# Altium project main.PrjPcb (part 2 of 2)

## Sheet SunS_Decoupler.SchDoc: SunS separator
size A4; Author: Grzegorz Gajoch; DocumentNumber: 4; SheetNumber: 4; SheetTotal: 16; Model: EM1; PageSetup: Record=PageOptions|CenterHorizontal=True|CenterVertical=True|PrintScale=0.52|XCorrection=1.00|YCorrection=1.00|PrintKind=1|BorderSize=5000000|LeftOffset=0|BottomOffset=0|Orientation=2|PaperLength=4200|PaperWidth=2970|Scale=100|PaperSource=7|PrintQuality=600|MediaType=1|DitherType=10|PaperKind=A3|PrintScaleMode=1
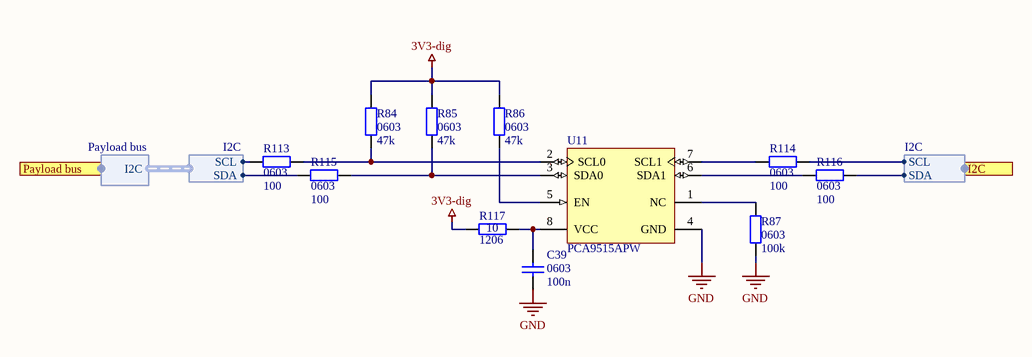
[diagram p10: SunS_Decoupler.SchDoc]

### Parts
C39  0603  value 100n  [SMD_Capacitor_0603]
R84  0603  value 47k  [SMD_Resistor_0603]
R85  0603  value 47k  [SMD_Resistor_0603]
R86  0603  value 47k  [SMD_Resistor_0603]
R87  0603  value 100k  [SMD_Resistor_0603]
R113  0603  value 100  [SMD_Resistor_0603]
R114  0603  value 100  [SMD_Resistor_0603]
R115  0603  value 100  [SMD_Resistor_0603]
R116  0603  value 100  [SMD_Resistor_0603]
R117  1206  value 10  [SMD_Resistor_1206]
U11  PCA9515APW  [PW8_L]

### Ports
I2C (harness I2C), Payload bus (harness Payload bus)

### Harnesses
I2C: SCL, SDA
Payload bus: I2C

### Nets
3V3-dig: R84.2 R85.2 R86.2 R117.2  [project net Vcc3]
GND: C39.1 R87.1 U11.4(GND)  [project net Ground1]
NetC39_2: C39.2 R117.1 U11.8(VCC)
NetP3_1: R113.2 ; harness I2C.SCL
NetP3_2: R115.2 ; harness I2C.SDA
NetR11_1: R116.1 ; port I2C.SDA
NetR12_1: R114.1 ; port I2C.SCL
NetR84_1: R84.1 R113.1 U11.2(SCL0)
NetR85_1: R85.1 R115.1 U11.3(SDA0)
NetR86_1: R86.1 U11.5(EN)
NetR87_2: R87.2 U11.1(NC)
NetR114_2: R114.2 U11.7(SCL1)
NetR116_2: R116.2 U11.6(SDA1)

### Notes on the sheet
- Title:
- Sheet:
- of
- Author:
- Model:
- Document Number:
- Checked by:
- Iss-Rev:
- Approved by:
- Date:
- File name:

### Library data of the parts
C39 = Cap1: Capacitor; Published: 8-Jun-2000; LatestRevisionDate: 17-Jul-2002; LatestRevisionNote: Re-released for DXP Platform.; PackageReference: RAD-0.3; Publisher: Altium Limited; PackageDescription: Radial Cap, Thru-Hole; 2 Leads; 0.3 in Pin Spacing
R84-R87 R113-R117 = Res2: Resistor; Published: 8-Jun-2000; LatestRevisionDate: 17-Jul-2002; LatestRevisionNote: Re-released for DXP Platform.; PackageReference: AXIAL-0.4; Publisher: Altium Limited; PackageDescription: Axial Device, Thru-Hole; 2 Leads; 0.4 in Pin Spacing
U11 = PCA9515APW: Dual Bidirectional I2C Bus and SMBus Repeater, 2 Channel Width, 2.3 to 3.6 V, -40 to 85 degC, 8-pin TSSOP (PW), Green (RoHS & no Sb/Br); Manufacturer: Texas Instruments; SubFamily: I2C Hub, Buffer, Repeater; No. of Outputs: 2; VCC(Max)(V): 3.6; VCC(Min)(V): 2.3; Max Frequency(kHz): 400; Vcc range(V): 2.3 to 5.5; 5V Tolerant I/O: Yes; DatasheetVersion: SCPS150B; PackageVersion: revG, Feb-2011; PackageReference: PW8; PackageDescription: 8-Pin Plastic Thin Small Outline Package 3 x 4.4 mm Body ,0.65 mm Pitch; Supplier 1: Digi-Key; Supplier Part Number 1: PCA9515APW-ND; Supplier 2: Newark; Supplier Part Number 2: 80K2693; Supplier 3: Mouser; Supplier Part Number 3: 595-PCA9515APW; Eco-Plan: Green (RoHS & no Sb/Br); Channel Width: 2; Master Side I2C Bus Capacitance Supported(pF): 400; Slave Side I2C Bus Capacitance Supported(pF): 400; Open Drain I/O Type: Yes; Enable Pin: Yes; Mounting Technology: Surface Mount; PartNumber: PCA9515APW; Code_JEDEC: MO-153; ComponentLink1Description: Datasheet; ComponentLink1URL: http://www.ti.com/general/docs/lit/getliterature.tsp?genericPartNumber=PCA9515A&fileType=pdf

## Sheet FRAM.SchDoc: FRAM Memory
size A3; DocumentNumber: 15; SheetNumber: 15; SheetTotal: 16; Model: EM1; PageSetup: Record=PageOptions|CenterHorizontal=True|CenterVertical=True|PrintScale=0.52|XCorrection=1.00|YCorrection=1.00|PrintKind=1|BorderSize=5000000|LeftOffset=0|BottomOffset=0|Orientation=2|PaperLength=4200|PaperWidth=2970|Scale=100|PaperSource=7|PrintQuality=600|MediaType=1|DitherType=10|PaperKind=A3|PrintScaleMode=1
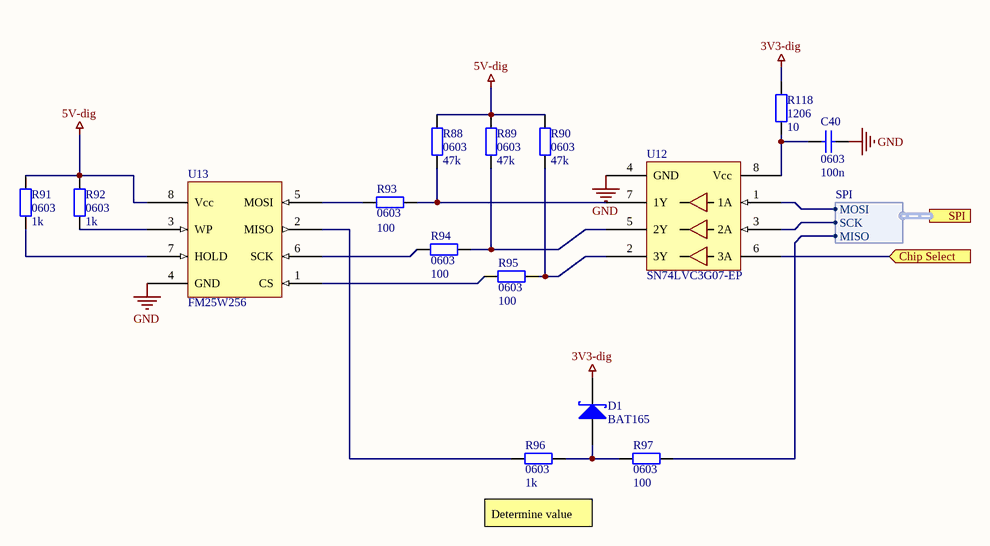
[diagram p11: FRAM.SchDoc]

### Parts
C40  0603  value 100n  [SMD_Capacitor_0603]
D1  BAT165  [SOD323]
R88  0603  value 47k  [SMD_Resistor_0603]
R89  0603  value 47k  [SMD_Resistor_0603]
R90  0603  value 47k  [SMD_Resistor_0603]
R91  0603  value 1k  [SMD_Resistor_0603]
R92  0603  value 1k  [SMD_Resistor_0603]
R93  0603  value 100  [SMD_Resistor_0603]
R94  0603  value 100  [SMD_Resistor_0603]
R95  0603  value 100  [SMD_Resistor_0603]
R96  0603  value 1k  [SMD_Resistor_0603]
R97  0603  value 100  [SMD_Resistor_0603]
R118  1206  value 10  [SMD_Resistor_1206]
U12  SN74LVC3G07-EP  [VSSOP-8]
U13  FM25W256  [SOIC-8-N]

### Ports
Chip Select (in), SPI (harness SPI)

### Harnesses
SPI: MOSI, MISO, SCK

### Nets
3V3-dig: D1.K R118.1  [project net Vcc3]
5V-dig: R88.2 R89.2 R90.2 R91.2 R92.2 U13.8(Vcc)
GND: C40.1 U12.4(GND) U13.4(GND)  [project net Ground1]
CS_FRAM_I: U12.6(3A) ; port Chip Select
MISO_FRAM: R97.1 ; port SPI.MISO
NetC40_2: C40.2 R118.2 U12.8(Vcc)
NetD1_A: D1.A R96.1 R97.2
NetR88_1: R88.1 R93.1 U12.7(1Y)
NetR89_1: R89.1 R94.1 U12.5(2Y)
NetR90_1: R90.1 R95.1 U12.2(3Y)
NetR91_1: R91.1 U13.7(HOLD)
NetR92_1: R92.1 U13.3(WP)
NetR93_2: R93.2 U13.5(MOSI)
NetR94_2: R94.2 U13.6(SCK)
NetR95_2: R95.2 U13.1(CS)
NetR96_2: R96.2 U13.2(MISO)
NetR108_2: U12.3(2A) ; port SPI.SCK
NetR109_2: U12.1(1A) ; port SPI.MOSI

### Notes on the sheet
- Determine value
- Title:
- Sheet:
- of
- Author:
- Model:
- Document Number:
- Checked by:
- Iss-Rev:
- Approved by:
- Date:
- File name:

### Library data of the parts
C40 = Cap1: Capacitor; Published: 8-Jun-2000; LatestRevisionDate: 17-Jul-2002; LatestRevisionNote: Re-released for DXP Platform.; PackageReference: RAD-0.3; Publisher: Altium Limited; PackageDescription: Radial Cap, Thru-Hole; 2 Leads; 0.3 in Pin Spacing
D1 = BAT165: Madium Power AF Schottky 750mA 40V Diode; Manufacturer: Infineon; Value: BAT165
R88-R97 R118 = Res2: Resistor; Published: 8-Jun-2000; LatestRevisionDate: 17-Jul-2002; LatestRevisionNote: Re-released for DXP Platform.; PackageReference: AXIAL-0.4; Publisher: Altium Limited; PackageDescription: Axial Device, Thru-Hole; 2 Leads; 0.4 in Pin Spacing
U12 = SN74LVC3G07-EP: Triple Buffer/Driver With Open-Drain Output
U13 = FM25W256: 256Kb (8k x 32) SPI F-RAM

## Sheet Flash.SchDoc: Flash memory
size A4; Author: Michał Gumiela; DocumentNumber: 1; SheetNumber: 1; SheetTotal: 16; Model: EM1; PageSetup: Record=PageOptions|CenterHorizontal=True|CenterVertical=True|PrintScale=0.52|XCorrection=1.00|YCorrection=1.00|PrintKind=1|BorderSize=5000000|LeftOffset=0|BottomOffset=0|Orientation=2|PaperLength=4200|PaperWidth=2970|Scale=100|PaperSource=7|PrintQuality=600|MediaType=1|DitherType=10|PaperKind=A3|PrintScaleMode=1
Used 2 times, as channels FLASH, FLASH. Parts and nets are listed once, with the designators drawn on the sheet.
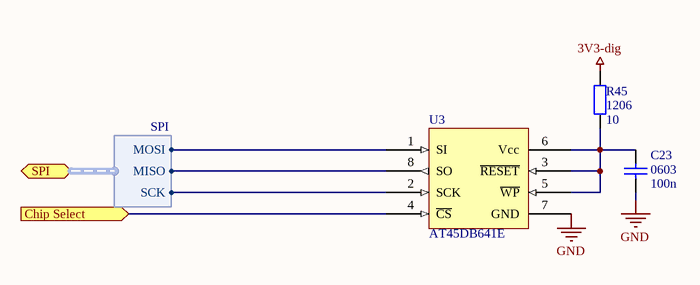
[diagram p12: Flash.SchDoc]

### Parts
C23  0603  value 100n  [SMD_Capacitor_0603]
R45  1206  value 10  [SMD_Resistor_1206]
U3  AT45DB641E  [SOIC-8-N]

### Ports
Chip Select (in), SPI (harness SPI)

### Harnesses
SPI: MOSI, MISO, SCK

### Nets
3V3-dig: R45.1
GND: C23.1 U3.7(GND)
Chip Select: U3.4(~{CS}) ; port Chip Select
NetC23_2: C23.2 R45.2 U3.3(~{RESET}) U3.5(~{WP}) U3.6(Vcc)
NetU3_1: U3.1(SI) ; port SPI.MOSI
NetU3_2: U3.2(SCK) ; port SPI.SCK
NetU3_8: U3.8(SO) ; port SPI.MISO

### Channels
FLASH: designators end in _FLASH#1; ports Chip Select=CS_FLASH_A_I
FLASH: designators end in _FLASH#2; ports Chip Select=CS_FLASH_B_I

### Notes on the sheet
- Title:
- Sheet:
- of
- Author:
- Model:
- Document Number:
- Checked by:
- Iss-Rev:
- Approved by:
- Date:
- File name:

### Library data of the parts
C23 = Cap1: Capacitor; Published: 8-Jun-2000; LatestRevisionDate: 17-Jul-2002; LatestRevisionNote: Re-released for DXP Platform.; PackageReference: RAD-0.3; Publisher: Altium Limited; PackageDescription: Radial Cap, Thru-Hole; 2 Leads; 0.3 in Pin Spacing
R45 = Res2: Resistor; Published: 8-Jun-2000; LatestRevisionDate: 17-Jul-2002; LatestRevisionNote: Re-released for DXP Platform.; PackageReference: AXIAL-0.4; Publisher: Altium Limited; PackageDescription: Axial Device, Thru-Hole; 2 Leads; 0.4 in Pin Spacing
U3 = AT45DB641E: 64-Mbit DataFlash (with Extra 2-Mbits)

## Sheet Watchdog.SchDoc: 24-bit Analog to Digital converter
size A4; Author: Grzegorz Gajoch; DocumentNumber: 6; SheetNumber: 6; SheetTotal: 16; Model: EM1; PageSetup: Record=PageOptions|CenterHorizontal=True|CenterVertical=True|PrintScale=0.52|XCorrection=1.00|YCorrection=1.00|PrintKind=1|BorderSize=5000000|LeftOffset=0|BottomOffset=0|Orientation=2|PaperLength=4200|PaperWidth=2970|Scale=100|PaperSource=7|PrintQuality=600|MediaType=1|DitherType=10|PaperKind=A3|PrintScaleMode=1
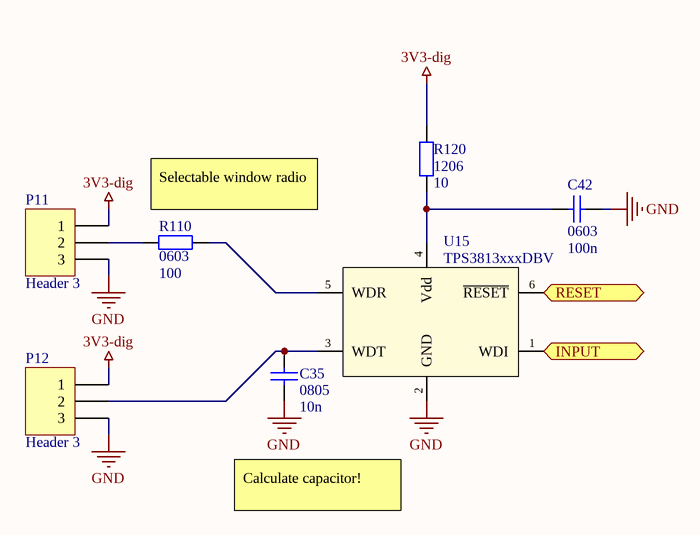
[diagram p13: Watchdog.SchDoc]

### Parts
C35  0805  value 10n  [SMD_Capacitor_0805]
C42  0603  value 100n  [SMD_Capacitor_0603]
P11  Header 3  [HDR1X3]
P12  Header 3  [HDR1X3]
R110  0603  value 100  [SMD_Resistor_0603]
R120  1206  value 10  [SMD_Resistor_1206]
U15  TPS3813xxxDBV  [SOT23-6]

### Ports
INPUT (in), RESET (out)

### Nets
3V3-dig: P11.1 P12.1 R120.1  [project net Vcc3]
GND: C35.1 C42.1 P11.3 P12.3 U15.2(GND)  [project net Ground1]
AT_NRST: U15.6(~{RESET}) ; port RESET
NetC35_2: C35.2 P12.2 U15.3(WDT)
NetC42_2: C42.2 R120.2 U15.4(Vdd)
NetP11_2: P11.2 R110.1
NetR110_2: R110.2 U15.5(WDR)
NetU4_25: U15.1(WDI) ; port INPUT

### Notes on the sheet
- (near R110) Selectable window radio
- Calculate capacitor!
- Title:
- Sheet:
- of
- Author:
- Model:
- Document Number:
- Checked by:
- Iss-Rev:
- Approved by:
- Date:
- File name:

### Library data of the parts
C35 = Cap: Capacitor; Published: 8-Jun-2000; LatestRevisionDate: 17-Jul-2002; LatestRevisionNote: Re-released for DXP Platform.; PackageReference: RAD-0.3; Publisher: Altium Limited; PackageDescription: Radial Cap, Thru-Hole; 2 Leads; 0.3 in Pin Spacing
C42 = Cap1: Capacitor; Published: 8-Jun-2000; LatestRevisionDate: 17-Jul-2002; LatestRevisionNote: Re-released for DXP Platform.; PackageReference: RAD-0.3; Publisher: Altium Limited; PackageDescription: Radial Cap, Thru-Hole; 2 Leads; 0.3 in Pin Spacing
P11 P12 = Header 3: Header, 3-Pin; LatestRevisionDate: 17-Jul-2002; LatestRevisionNote: Re-released for DXP Platform.; Publisher: Altium Limited
R110 R120 = Res2: Resistor; Published: 8-Jun-2000; LatestRevisionDate: 17-Jul-2002; LatestRevisionNote: Re-released for DXP Platform.; PackageReference: AXIAL-0.4; Publisher: Altium Limited; PackageDescription: Axial Device, Thru-Hole; 2 Leads; 0.4 in Pin Spacing
U15 = TPS3813xxxDBV: Processor Supervisory Circuits with Window-Watchdog.; Manufacturer: Texas Instruments; Value: TPS3813xxxDBV

## Sheet SPI Buffer.SchDoc: Flash memory
size A4; Author: Michał Gumiela; DocumentNumber: 14; SheetNumber: 14; SheetTotal: 16; Model: EM1; PageSetup: Record=PageOptions|CenterHorizontal=True|CenterVertical=True|PrintScale=0.52|XCorrection=1.00|YCorrection=1.00|PrintKind=1|BorderSize=5000000|LeftOffset=0|BottomOffset=0|Orientation=2|PaperLength=4200|PaperWidth=2970|Scale=100|PaperSource=7|PrintQuality=600|MediaType=1|DitherType=10|PaperKind=A3|PrintScaleMode=1
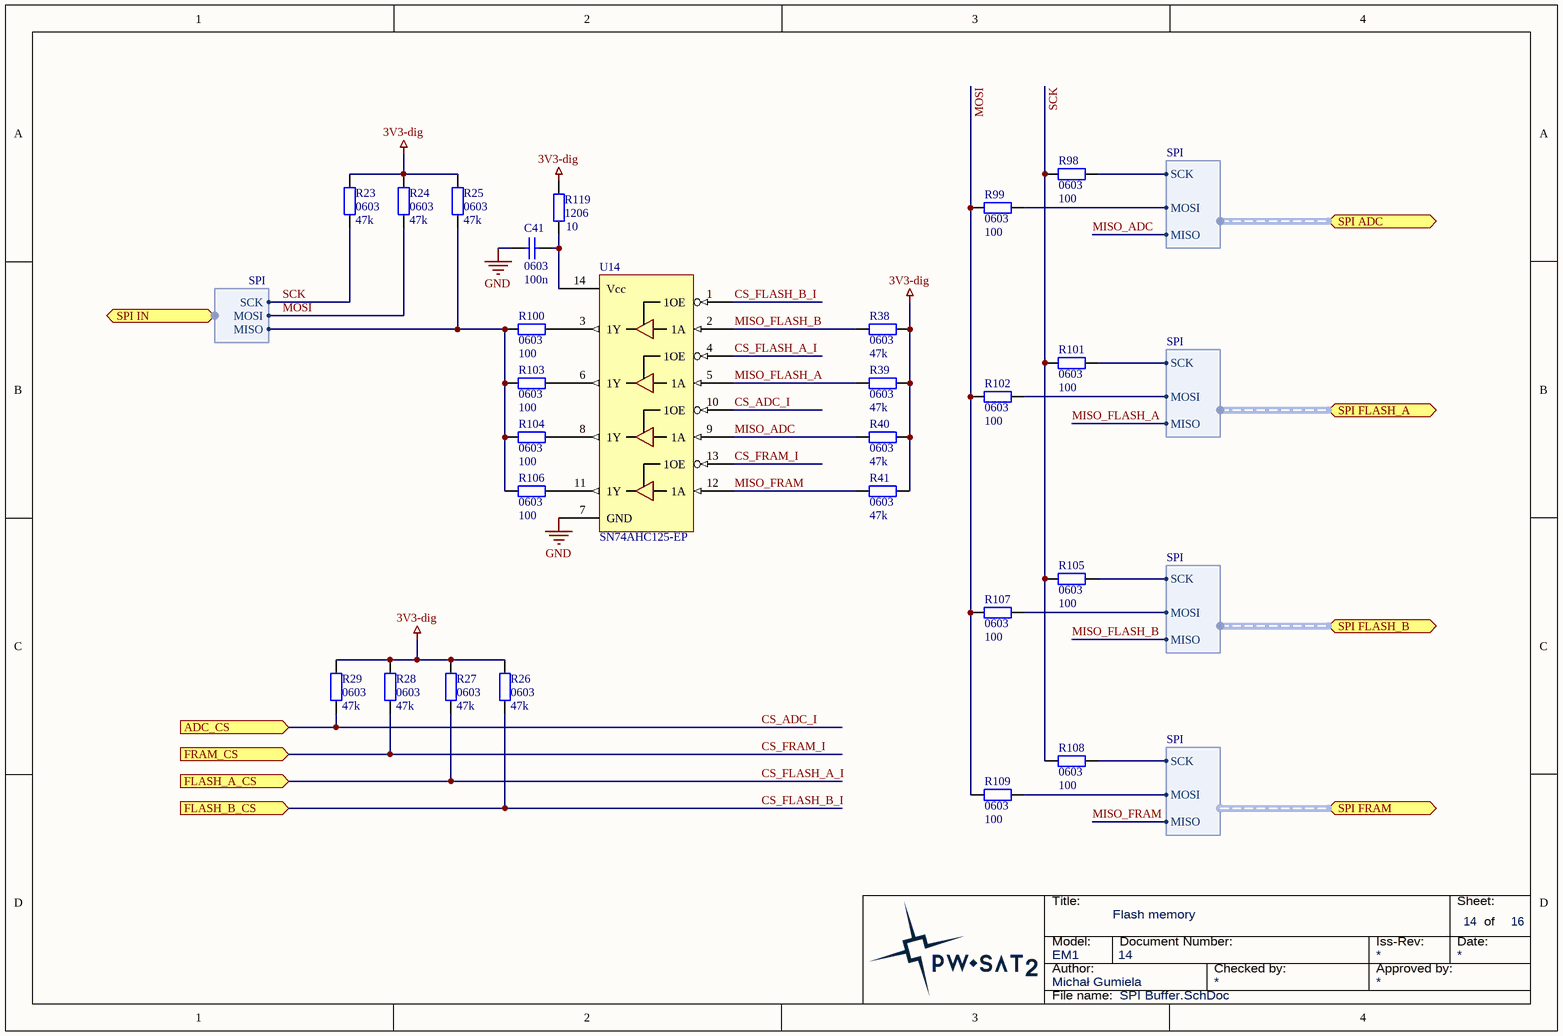
[diagram p14: SPI Buffer.SchDoc]

### Parts
C41  0603  value 100n  [SMD_Capacitor_0603]
R23  0603  value 47k  [SMD_Resistor_0603]
R24  0603  value 47k  [SMD_Resistor_0603]
R25  0603  value 47k  [SMD_Resistor_0603]
R26  0603  value 47k  [SMD_Resistor_0603]
R27  0603  value 47k  [SMD_Resistor_0603]
R28  0603  value 47k  [SMD_Resistor_0603]
R29  0603  value 47k  [SMD_Resistor_0603]
R38  0603  value 47k  [SMD_Resistor_0603]
R39  0603  value 47k  [SMD_Resistor_0603]
R40  0603  value 47k  [SMD_Resistor_0603]
R41  0603  value 47k  [SMD_Resistor_0603]
R98  0603  value 100  [SMD_Resistor_0603]
R99  0603  value 100  [SMD_Resistor_0603]
R100  0603  value 100  [SMD_Resistor_0603]
R101  0603  value 100  [SMD_Resistor_0603]
R102  0603  value 100  [SMD_Resistor_0603]
R103  0603  value 100  [SMD_Resistor_0603]
R104  0603  value 100  [SMD_Resistor_0603]
R105  0603  value 100  [SMD_Resistor_0603]
R106  0603  value 100  [SMD_Resistor_0603]
R107  0603  value 100  [SMD_Resistor_0603]
R108  0603  value 100  [SMD_Resistor_0603]
R109  0603  value 100  [SMD_Resistor_0603]
R119  1206  value 10  [SMD_Resistor_1206]
U14  SN74AHC125-EP  [TSSOP14_L]

### Ports
ADC_CS (in), FLASH_A_CS (in), FLASH_B_CS (in), FRAM_CS (in), SPI ADC (harness SPI), SPI FLASH_A (harness SPI), SPI FLASH_B (harness SPI), SPI FRAM (harness SPI), SPI IN (harness SPI)

### Harnesses
SPI: MOSI, MISO, SCK

### Nets
3V3-dig: R23.2 R24.2 R25.2 R26.2 R27.2 R28.2 R29.2 R38.1 R39.1 R40.1 R41.1 R119.1  [project net Vcc3]
GND: C41.2 U14.7(GND)  [project net Ground1]
CS_ADC_I: R29.1 U14.10(1OE) ; port ADC_CS
CS_FLASH_A_I: R27.1 U14.4(1OE) ; port FLASH_A_CS
CS_FLASH_B_I: R26.1 U14.1(1OE) ; port FLASH_B_CS
CS_FRAM_I: R28.1 U14.13(1OE) ; port FRAM_CS
MISO: R25.1 R100.1 R103.1 R104.1 R106.1 ; port SPI IN.MISO
MISO_ADC: R40.2 U14.9(1A) ; port SPI ADC.MISO
MISO_FLASH_A: R39.2 U14.5(1A) ; port SPI FLASH_A.MISO
MISO_FLASH_B: R38.2 U14.2(1A) ; port SPI FLASH_B.MISO
MISO_FRAM: R41.2 U14.12(1A) ; port SPI FRAM.MISO
MOSI: R24.1 R99.1 R102.1 R107.1 R109.1 ; port SPI IN.MOSI
SCK: R23.1 R98.1 R101.1 R105.1 R108.1 ; port SPI IN.SCK
NetC41_1: C41.1 R119.2 U14.14(Vcc)
NetR98_2: R98.2 ; port SPI ADC.SCK
NetR99_2: R99.2 ; port SPI ADC.MOSI
NetR100_2: R100.2 U14.3(1Y)
NetR101_2: R101.2 ; port SPI FLASH_A.SCK
NetR102_2: R102.2 ; port SPI FLASH_A.MOSI
NetR103_2: R103.2 U14.6(1Y)
NetR104_2: R104.2 U14.8(1Y)
NetR105_2: R105.2 ; port SPI FLASH_B.SCK
NetR106_2: R106.2 U14.11(1Y)
NetR107_2: R107.2 ; port SPI FLASH_B.MOSI
NetR108_2: R108.2 ; port SPI FRAM.SCK
NetR109_2: R109.2 ; port SPI FRAM.MOSI

### Notes on the sheet
- Title:
- Sheet:
- of
- Author:
- Model:
- Document Number:
- Checked by:
- Iss-Rev:
- Approved by:
- Date:
- File name:

### Library data of the parts
C41 = Cap1: Capacitor; Published: 8-Jun-2000; LatestRevisionDate: 17-Jul-2002; LatestRevisionNote: Re-released for DXP Platform.; PackageReference: RAD-0.3; Publisher: Altium Limited; PackageDescription: Radial Cap, Thru-Hole; 2 Leads; 0.3 in Pin Spacing
R23-R29 R38-R41 R98-R109 R119 = Res2: Resistor; Published: 8-Jun-2000; LatestRevisionDate: 17-Jul-2002; LatestRevisionNote: Re-released for DXP Platform.; PackageReference: AXIAL-0.4; Publisher: Altium Limited; PackageDescription: Axial Device, Thru-Hole; 2 Leads; 0.4 in Pin Spacing
U14 = SN74AHC125-EP: QUADRUPLE BUS BUFFER GATE  WITH 3-STATE OUTPUTS

## Sheet LM60 - mul.SchDoc: LM60 temperature sensors
size A4; Author: Grzegorz Gajoch; DocumentNumber: 6; SheetNumber: 6; SheetTotal: 16; Model: EM1; PageSetup: Record=PageOptions|CenterHorizontal=True|CenterVertical=True|PrintScale=0.52|XCorrection=1.00|YCorrection=1.00|PrintKind=1|BorderSize=5000000|LeftOffset=0|BottomOffset=0|Orientation=2|PaperLength=4200|PaperWidth=2970|Scale=100|PaperSource=7|PrintQuality=600|MediaType=1|DitherType=10|PaperKind=A3|PrintScaleMode=1
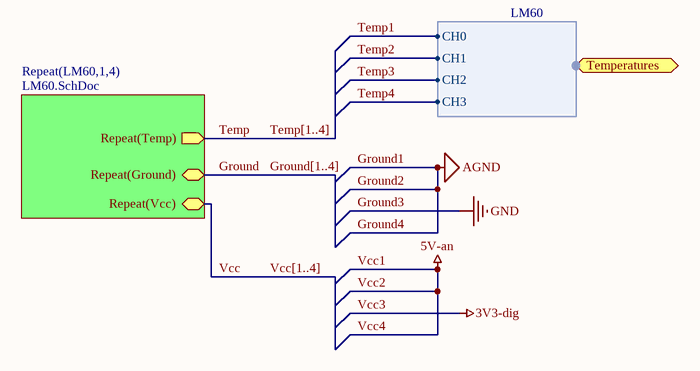
[diagram p15: LM60 - mul.SchDoc]

### Sub-sheets
Repeat(LM60,1,4) = LM60.SchDoc: Repeat(Temp) (out), Repeat(Ground), Repeat(Vcc)

### Ports
Temperatures (harness LM60)

### Harnesses
LM60: CH0, CH1, CH2, CH3

### Buses and harness runs
bus Ground[1..4]
bus Temp[1..4]
bus Vcc[1..4]

### Notes on the sheet
- Title:
- Sheet:
- of
- Author:
- Model:
- Document Number:
- Checked by:
- Iss-Rev:
- Approved by:
- Date:
- File name:

## Sheet LM60.SchDoc: 24-bit Analog to Digital converter
size A4; Author: Grzegorz Gajoch; DocumentNumber: 6; SheetNumber: 6; SheetTotal: 16; Model: EM1; PageSetup: Record=PageOptions|CenterHorizontal=True|CenterVertical=True|PrintScale=0.52|XCorrection=1.00|YCorrection=1.00|PrintKind=1|BorderSize=5000000|LeftOffset=0|BottomOffset=0|Orientation=2|PaperLength=4200|PaperWidth=2970|Scale=100|PaperSource=7|PrintQuality=600|MediaType=1|DitherType=10|PaperKind=A3|PrintScaleMode=1
Used 4 times, as channels LM60 Sensors/LM601, LM60 Sensors/LM602, LM60 Sensors/LM603, LM60 Sensors/LM604. Parts and nets are listed once, with the designators drawn on the sheet.
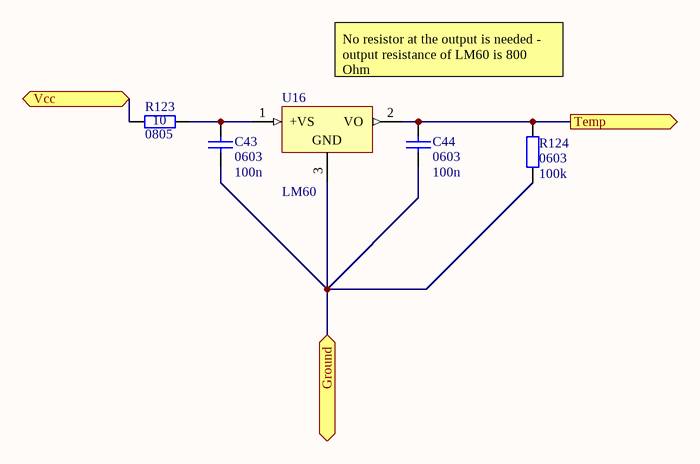
[diagram p16: LM60.SchDoc]

### Parts
C43  0603  value 100n  [SMD_Capacitor_0603]
C44  0603  value 100n  [SMD_Capacitor_0603]
R123  0805  value 10  [SMD_Resistor_0805]
R124  0603  value 100k  [SMD_Resistor_0603]
U16  LM60  [SOT23-3]

### Ports
Ground, Temp (out), Vcc

### Nets
Ground: C43.1 C44.1 R124.1 U16.3(GND) ; port Ground
Temp: C44.2 R124.2 U16.2(VO) ; port Temp
Vcc: R123.1 ; port Vcc
NetC43_2: C43.2 R123.2 U16.1(+VS)

### Channels
LM60 Sensors/LM601: designators end in _LM601; ports Ground=Ground1 Temp=Temp1 Vcc=Vcc1
LM60 Sensors/LM602: designators end in _LM602; ports Ground=Ground1 Temp=Temp2 Vcc=Vcc1
LM60 Sensors/LM603: designators end in _LM603; ports Ground=Ground1 Temp=Temp3 Vcc=Vcc3
LM60 Sensors/LM604: designators end in _LM604; ports Ground=Ground1 Temp=Temp4 Vcc=Vcc1

### Notes on the sheet
- No resistor at the output is needed - output resistance of LM60 is 800 Ohm
- Title:
- Sheet:
- of
- Author:
- Model:
- Document Number:
- Checked by:
- Iss-Rev:
- Approved by:
- Date:
- File name:

### Library data of the parts
C43 C44 = Cap: Capacitor; Published: 8-Jun-2000; LatestRevisionDate: 17-Jul-2002; LatestRevisionNote: Re-released for DXP Platform.; PackageReference: RAD-0.3; Publisher: Altium Limited; PackageDescription: Radial Cap, Thru-Hole; 2 Leads; 0.3 in Pin Spacing
R123 R124 = Res2: Resistor; Published: 8-Jun-2000; LatestRevisionDate: 17-Jul-2002; LatestRevisionNote: Re-released for DXP Platform.; PackageReference: AXIAL-0.4; Publisher: Altium Limited; PackageDescription: Axial Device, Thru-Hole; 2 Leads; 0.4 in Pin Spacing
U16 = LM60: Analog temperature sensor

## Nets that join several sheets
5V-dig: PowerManagement (C19.1 C20.2 L2.2 R34.2), FRAM (6 pins)
Ground1: MCU (22 pins), SolarConnections (P5.2 P5.5 P6.2 P6.5), SatBusConnections (P4.3), RTD_interface (15 pins), Solars (18 pins), Solar_interface/Current_Limit_CH0 (R1_Current_Limit_CH0.2 R2_Current_Limit_CH0.1 R3_Current_Limit_CH0.2 U2_Current_Limit_CH0.5), Solar_interface/Current_Limit_CH1 (R1_Current_Limit_CH1.2 R2_Current_Limit_CH1.1 R3_Current_Limit_CH1.2 U2_Current_Limit_CH1.5), Solar_interface/Current_Limit_CH2 (R1_Current_Limit_CH2.2 R2_Current_Limit_CH2.1 R3_Current_Limit_CH2.2 U2_Current_Limit_CH2.5), Solar_interface/Current_Limit_CH3 (R1_Current_Limit_CH3.2 R2_Current_Limit_CH3.1 R3_Current_Limit_CH3.2 U2_Current_Limit_CH3.5), ReferenceVoltage (8 pins), ADC (13 pins), RTD_interface (15 pins), PowerManagement (16 pins), SunS_Decoupler (C39.1 R87.1 U11.4), FRAM (C40.1 U12.4 U13.4), FLASH (C23_FLASH#1.1 U3_FLASH#1.7), FLASH (C23_FLASH#2.1 U3_FLASH#2.7), Watchdog (5 pins), SPI Buffer (C41.2 U14.7), LM60 Sensors/LM601 (C43_LM601.1 C44_LM601.1 R124_LM601.1 U16_LM601.3), LM60 Sensors/LM602 (C43_LM602.1 C44_LM602.1 R124_LM602.1 U16_LM602.3), LM60 Sensors/LM603 (C43_LM603.1 C44_LM603.1 R124_LM603.1 U16_LM603.3), LM60 Sensors/LM604 (C43_LM604.1 C44_LM604.1 R124_LM604.1 U16_LM604.3)
Vcc1: RTD_interface (R76_RTD_interface#1.2 R111_RTD_interface#1.2), Solars (C31.1 R112.2 U9.2), ReferenceVoltage (C25.2 R42.1), ADC (R43.1), RTD_interface (R76_RTD_interface#2.2 R111_RTD_interface#2.2), PowerManagement (C15.2 C17.1 L1.2 R33.2), LM60 Sensors/LM601 (R123_LM601.1), LM60 Sensors/LM602 (R123_LM602.1), LM60 Sensors/LM604 (R123_LM604.1)
Vcc3: MCU (20 pins), ADC (R44.1 R127.2), PowerManagement (C22.1 R36.2 U5.1 U5.2), SunS_Decoupler (R84.2 R85.2 R86.2 R117.2), FRAM (D1.K R118.1), FLASH (R45_FLASH#1.1), FLASH (R45_FLASH#2.1), Watchdog (P11.1 P12.1 R120.1), SPI Buffer (12 pins), LM60 Sensors/LM603 (R123_LM603.1)
2.5V-ref: RTD_interface (C30_RTD_interface#1.1 R56_RTD_interface#1.2), ReferenceVoltage (C26.2 R47.2 U6.6 U6.7), ADC (C3.2 U1.8 U1.10 U1.15), RTD_interface (C30_RTD_interface#2.1 R56_RTD_interface#2.2)
5V: SatBusConnections (P4.1), PowerManagement (8 pins)
AT_NRST: MCU (5 pins), Watchdog (U15.6)
CH2_PGOOD: MCU (R132.1 U4.35), Solar_interface/Current_Limit_CH2 (U2_Current_Limit_CH2.2)
CS_ADC_I: MCU (R7.1), ADC (U1.19), SPI Buffer (R29.1 U14.10)
CS_FLASH_A_I: MCU (R9.1), FLASH (U3_FLASH#1.4), SPI Buffer (R27.1 U14.4)
CS_FLASH_B_I: MCU (R10.1), FLASH (U3_FLASH#2.4), SPI Buffer (R26.1 U14.1)
CS_FRAM_I: MCU (R8.1), FRAM (U12.6), SPI Buffer (R28.1 U14.13)
FLAGB: MCU (R134.1 U4.30), Solar_interface/Current_Limit_CH3 (U2_Current_Limit_CH3.7)
FLAGB: MCU (R131.1 U4.33), Solar_interface/Current_Limit_CH2 (U2_Current_Limit_CH2.7)
FLAGB: MCU (R128.1 U4.36), Solar_interface/Current_Limit_CH1 (U2_Current_Limit_CH1.7)
FLAGB: MCU (R4.1 U4.39), Solar_interface/Current_Limit_CH0 (U2_Current_Limit_CH0.7)
MISO: MCU (U4.13), SPI Buffer (5 pins)
MISO_ADC: ADC (U1.21), SPI Buffer (R40.2 U14.9)
MISO_FLASH_A: FLASH (U3_FLASH#1.8), SPI Buffer (R39.2 U14.5)
MISO_FLASH_B: FLASH (U3_FLASH#2.8), SPI Buffer (R38.2 U14.2)
MISO_FRAM: FRAM (R97.1), SPI Buffer (R41.2 U14.12)
MOSI: MCU (U4.12), SPI Buffer (5 pins)
NetC32_1: Solars (C32.1 R75.2 U9.4), Solar_interface/Current_Limit_CH0 (U2_Current_Limit_CH0.1), Solar_interface/Current_Limit_CH1 (U2_Current_Limit_CH1.1), Solar_interface/Current_Limit_CH2 (U2_Current_Limit_CH2.1), Solar_interface/Current_Limit_CH3 (U2_Current_Limit_CH3.1)
NetP3_1: SatBusConnections (P3.1), SunS_Decoupler (R113.2)
NetP3_2: SatBusConnections (P3.2), SunS_Decoupler (R115.2)
NetP5_1: SolarConnections (P5.1), RTD_interface (U7_RTD_interface#1.4 U7_RTD_interface#1.13)
NetP5_3: SolarConnections (P5.3), RTD_interface (U7_RTD_interface#1.5 U7_RTD_interface#1.12)
NetP5_4: SolarConnections (P5.4), RTD_interface (U7_RTD_interface#1.6 U7_RTD_interface#1.11)
NetP5_6: SolarConnections (P5.6), RTD_interface (U7_RTD_interface#1.7 U7_RTD_interface#1.10)
NetP6_1: SolarConnections (P6.1), RTD_interface (U7_RTD_interface#2.4 U7_RTD_interface#2.13)
NetP6_3: SolarConnections (P6.3), RTD_interface (U7_RTD_interface#2.5 U7_RTD_interface#2.12)
NetP6_4: SolarConnections (P6.4), RTD_interface (U7_RTD_interface#2.6 U7_RTD_interface#2.11)
NetP6_6: SolarConnections (P6.6), RTD_interface (U7_RTD_interface#2.7 U7_RTD_interface#2.10)
NetP7_1: SolarConnections (P7.1), Solar_interface/Current_Limit_CH0 (R1_Current_Limit_CH0.1 U2_Current_Limit_CH0.8)
NetP7_2: SolarConnections (P7.2), Solars (R80.4)
NetP8_1: SolarConnections (P8.1), Solar_interface/Current_Limit_CH1 (R1_Current_Limit_CH1.1 U2_Current_Limit_CH1.8)
NetP8_2: SolarConnections (P8.2), Solars (R81.4)
NetP9_1: SolarConnections (P9.1), Solar_interface/Current_Limit_CH2 (R1_Current_Limit_CH2.1 U2_Current_Limit_CH2.8)
NetP9_2: SolarConnections (P9.2), Solars (R82.4)
NetP10_1: SolarConnections (P10.1), Solar_interface/Current_Limit_CH3 (R1_Current_Limit_CH3.1 U2_Current_Limit_CH3.8)
NetP10_2: SolarConnections (P10.2), Solars (R83.4)
NetR11_1: MCU (R11.1 R22.2), SunS_Decoupler (R116.1)
NetR12_1: MCU (R12.1 R18.2), SunS_Decoupler (R114.1)
NetR17_2: MCU (R17.2), ADC (U1.20)
NetR19_2: MCU (R19.2), ADC (U1.6)
NetR20_2: MCU (R20.2), ADC (U1.11)
NetR21_2: MCU (R21.2), ADC (U1.13)
NetR53_RTD_interface#1_1: RTD_interface (R53_RTD_interface#1.1), ADC (U1.7)
NetR53_RTD_interface#2_1: ADC (U1.9), RTD_interface (R53_RTD_interface#2.1)
NetR58_RTD_interface#1_2: MCU (U4.46), RTD_interface (R58_RTD_interface#1.2)
NetR58_RTD_interface#2_2: MCU (U4.49), RTD_interface (R58_RTD_interface#2.2)
NetR59_RTD_interface#1_2: MCU (U4.47), RTD_interface (R59_RTD_interface#1.2)
NetR59_RTD_interface#2_2: MCU (U4.50), RTD_interface (R59_RTD_interface#2.2)
NetR60_RTD_interface#1_2: MCU (U4.45), RTD_interface (R60_RTD_interface#1.2)
NetR60_RTD_interface#2_2: MCU (U4.48), RTD_interface (R60_RTD_interface#2.2)
NetR68_2: MCU (U4.42), Solars (R68.2)
NetR69_2: MCU (U4.44), Solars (R69.2)
NetR73_2: MCU (U4.29), Solars (R73.2)
NetR79_2: Solars (R79.2), ADC (U1.16)
NetR98_2: ADC (U1.1), SPI Buffer (R98.2)
NetR99_2: ADC (U1.22), SPI Buffer (R99.2)
NetR101_2: FLASH (U3_FLASH#1.2), SPI Buffer (R101.2)
NetR102_2: FLASH (U3_FLASH#1.1), SPI Buffer (R102.2)
NetR105_2: FLASH (U3_FLASH#2.2), SPI Buffer (R105.2)
NetR107_2: FLASH (U3_FLASH#2.1), SPI Buffer (R107.2)
NetR108_2: FRAM (U12.3), SPI Buffer (R108.2)
NetR109_2: FRAM (U12.1), SPI Buffer (R109.2)
NetU1_17: Solars (U10.8), ADC (U1.17)
NetU4_25: MCU (U4.25), Watchdog (U15.1)
ON: MCU (R136.1 U4.31), Solar_interface/Current_Limit_CH3 (U2_Current_Limit_CH3.4)
ON: MCU (R133.1 U4.34), Solar_interface/Current_Limit_CH2 (U2_Current_Limit_CH2.4)
ON: MCU (R130.1 U4.37), Solar_interface/Current_Limit_CH1 (U2_Current_Limit_CH1.4)
ON: MCU (R6.1 U4.40), Solar_interface/Current_Limit_CH0 (U2_Current_Limit_CH0.4)
PGOOD: MCU (R135.1 U4.32), Solar_interface/Current_Limit_CH3 (U2_Current_Limit_CH3.2)
PGOOD: MCU (R129.1 U4.38), Solar_interface/Current_Limit_CH1 (U2_Current_Limit_CH1.2)
PGOOD: MCU (R5.1 U4.41), Solar_interface/Current_Limit_CH0 (U2_Current_Limit_CH0.2)
SCK: MCU (U4.11), SPI Buffer (5 pins)
SOL_A0: MCU (U4.43), Solars (R67.2)
Temp1: MCU (U4.61), LM60 Sensors/LM601 (C44_LM601.2 R124_LM601.2 U16_LM601.2)
Temp2: MCU (U4.60), LM60 Sensors/LM602 (C44_LM602.2 R124_LM602.2 U16_LM602.2)
Temp3: MCU (U4.59), LM60 Sensors/LM603 (C44_LM603.2 R124_LM603.2 U16_LM603.2)
Temp4: MCU (U4.58), LM60 Sensors/LM604 (C44_LM604.2 R124_LM604.2 U16_LM604.2)